# Altium schematic sheet LEDs.SchDoc
size A4; Organization: Altium Limited; Address1: L3, 12a Rodborough Rd; Address2: Frenchs Forest; Address3: NSW; Address4: Australia 2086
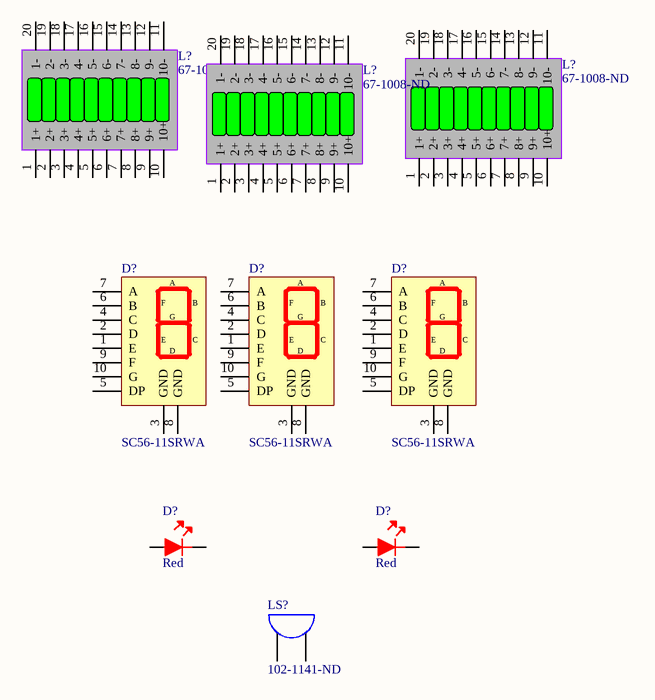
[diagram p0: LEDs.SchDoc]

## Parts
(Parts that share a designator on the sheet are numbered #1, #2 ... from top to bottom, then left to right.)
D?#1  SC56-11SRWA  [7-seg]
D?#2  SC56-11SRWA  [7-seg]
D?#3  SC56-11SRWA  [7-seg]
D?#4  Red  [LED-0603]
D?#5  Red  [LED-0603]
L?#1  67-1008-ND  [LEDBAR-10]
L?#2  67-1008-ND  [LEDBAR-10]
L?#3  67-1008-ND  [LEDBAR-10]
LS?  102-1141-ND  [Buzzer]

## Nets

Not connected (* = marked no-connect by the designer): D?#1 1(E) 2(D) 3(GND) 4(C) 5(DP) 6(B) 7(A) 8(GND) 9(F) 10(G); D?#2 1(E) 2(D) 3(GND) 4(C) 5(DP) 6(B) 7(A) 8(GND) 9(F) 10(G); D?#3 1(E) 2(D) 3(GND) 4(C) 5(DP) 6(B) 7(A) 8(GND) 9(F) 10(G); D?#4 1 2; D?#5 1 2; L?#1 1(1+) 2(2+) 3(3+) 4(4+) 5(5+) 6(6+) 7(7+) 8(8+) 9(9+) 10(10+) 11(10-) 12(9-) 13(8-) 14(7-) 15(6-) 16(5-) 17(4-) 18(3-) 19(2-) 20(1-); L?#2 1(1+) 2(2+) 3(3+) 4(4+) 5(5+) 6(6+) 7(7+) 8(8+) 9(9+) 10(10+) 11(10-) 12(9-) 13(8-) 14(7-) 15(6-) 16(5-) 17(4-) 18(3-) 19(2-) 20(1-); L?#3 1(1+) 2(2+) 3(3+) 4(4+) 5(5+) 6(6+) 7(7+) 8(8+) 9(9+) 10(10+) 11(10-) 12(9-) 13(8-) 14(7-) 15(6-) 16(5-) 17(4-) 18(3-) 19(2-) 20(1-); LS? 1 2

## Notes on the sheet
- Title
- Size:
- Date:
- A4
- Number:
- Time:
- Revision:
- Sheet
- of
- File:

## Library data of the parts
D?#1-D?#3 = 7-segment: DISPLAY 7SEG 0.56" SGL RED 10DIP; Manufacturer: Kingbright; Wavelength: 640nm; Luminous Intensity: 34mcd; Forward Voltage: 1.85V; Element Configuration: Common Cathode; Forward Current: 20mA; Number of Characters: 1; Max Power Dissipation: 75mW; Supplier 1: Digi-Key; Manufacturer Part Number: SC56-11SRWA; Stock 1: 32391; Pricing 1: 1=1.96, 10=1.24, 100=0.9177, 500=0.84334, 1000=0.702 (USD); Case/Package: DIP; Color: Red; Min Operating Temperature: -40°C; Max Operating Temperature: 85°C; Package Quantity: 40; Illumination Color: Red; Operating Supply Voltage: 1.85V; Packaging: Bulk; Test Current: 20mA; Display Type: Segment; Power Consumption: 75mW; Width: 0.5inch; Height: 0.75inch; RoHS Compliant: Yes; Lead Free: Lead Free; REACH SVHC: No SVHC; ComponentLink1URL: http://www.farnell.com/datasheets/2047590.pdf?src-supplier=Element14; ComponentLink1Description: http://www.farnell.com/datasheets/2047590.pdf?src-supplier=Element14; ComponentLink2URL: http://www.mouser.com/ds/2/216/SC56-11SRWA-66719.pdf?src-supplier=Mouser; ComponentLink2Description: http://www.mouser.com/ds/2/216/SC56-11SRWA-66719.pdf?src-supplier=Mouser; ComponentLink3URL: http://www.kingbrightusa.com/images/catalog/SPEC/SC56-11SRWA.pdf?src-supplier=Future+Electronics; ComponentLink3Description: http://www.kingbrightusa.com/images/catalog/SPEC/SC56-11SRWA.pdf?src-supplier=Future+Electronics; Supplier Part Number 1: 754-1467-5-ND
D?#4 D?#5 = LED-Red-Bright: LED RED CLEAR 0603 SMD; Manufacturer: Inolux; Manufacturer Part Number: IN-S63ATR; Lens Style: Flat; Luminous Intensity: 45mcd; Forward Voltage: 2.2V; Test Current: 20mA; Viewing Angle: 120°; Dominant Wavelength: 622nm; Lens Size: 0.8mm; Supplier 1: Digi-Key; Stock 1: 6977; Pricing 1: 1=0.33, 10=0.24, 100=0.1136, 500=0.07576, 1000=0.05934 (USD); Mount: Surface Mount; Case/Package: 0603; Color: Red; Lens Color: Clear; Case Code (Imperial): 0603; Case Code (Metric): 1608; Packaging: Cut Tape; Lens Transparency: Clear; Length: 1.6mm; Height: 0.4mm; Width: 0.8mm; ComponentLink1URL: http://www.inolux-corp.com/datasheet/SMDLED/Mono%20Color%20Top%20View/IN-S63AT%20Series_V1.1.pdf?src-supplier=Digi-Key; ComponentLink1Description: http://www.inolux-corp.com/datasheet/SMDLED/Mono%20Color%20Top%20View/IN-S63AT%20Series_V1.1.pdf?src-supplier=Digi-Key; Supplier Part Number 1: 1830-1065-6-ND
L?#1-L?#3 = LEDBAR-10-GRN: LED ARRAY 10X25MM 10SEG GRN DIFF; Manufacturer: Lumex; Manufacturer Part Number: SSA-LXB10GW-GF/LP; Color: Green; Voltage Rating: 2.2V; Operating Supply Voltage: 2.6V; Number of Contacts: 18; Display Type: Bar Graph; Luminous Intensity: 8mcd; Forward Current: 20mA; Wavelength: 565nm; Power Consumption: 105mW; Viewing Angle: 160°; Lens Style: Diffused; Current: 25mA; Number of LEDs: 10; Supplier 1: Digi-Key; Stock 1: 6048; Pricing 1: 1=2.28, 10=2.018, 100=1.1718, 500=1.0416, 1000=0.89513, 2500=0.8463, 5000=0.82677, 10000=0.81375 (USD); Mount: Through Hole; Min Operating Temperature: -40°C; Max Operating Temperature: 85°C; Package Quantity: 20; Packaging: Bulk; Forward Voltage: 2.2V; Illumination Color: Green; Length: 25.1mm; Height: 6.8mm; Width: 10.1mm; REACH SVHC: No SVHC; Lead Free: Lead Free; ComponentLink1URL: http://www.lumex.com/content/files/ProductAttachment/SSA-LXB10GW-GF-LP.pdf?src-supplier=Digi-Key; ComponentLink1Description: http://www.lumex.com/content/files/ProductAttachment/SSA-LXB10GW-GF-LP.pdf?src-supplier=Digi-Key; ComponentLink2URL: http://www.farnell.com/datasheets/677482.pdf?src-supplier=Farnell; ComponentLink2Description: http://www.farnell.com/datasheets/677482.pdf?src-supplier=Farnell; ComponentLink3URL: http://www.farnell.com/datasheets/677482.pdf?src-supplier=Element14; ComponentLink3Description: http://www.farnell.com/datasheets/677482.pdf?src-supplier=Element14; ComponentLink4URL: http://www.farnell.com/datasheets/269031.pdf?src-supplier=Element14; ComponentLink4Description: http://www.farnell.com/datasheets/269031.pdf?src-supplier=Element14; ComponentLink5URL: http://www.mouser.com/ds/2/244/SSA-LXB10GW-GF%20LP-115645.pdf?src-supplier=Mouser; ComponentLink5Description: http://www.mouser.com/ds/2/244/SSA-LXB10GW-GF%20LP-115645.pdf?src-supplier=Mouser; Supplier Part Number 1: 67-1008-ND
LS? = Buzzer: AUDIO PIEZO TRANSDUCER 30V TH; Manufacturer: CUI; Voltage Rating: 10V; Operating Supply Current: 8mA; Self Resonant Frequency: 2kHz; Capacitance: 28nF; Washable: No; Supplier 1: Digi-Key; Manufacturer Part Number: CEP-1116; Stock 1: 11267; Pricing 1: 1=1.91, 10=1.588, 25=1.468, 50=1.3806, 100=1.2963, 500=1.11268, 1000=1.0621 (USD); Mount: Through Hole; Case/Package: Radial; Min Operating Temperature: -30°C; Max Operating Temperature: 85°C; Packaging: Bulk; Termination: PC Pins; Diameter: 30mm; Height: 10.5mm; Lead Free: Lead Free; Supplier Part Number 1: 102-1141-ND